# Altium project Audio_Research.PrjPcb (part 4 of 6)

## Sheet Audio_Input_Mic_In.SchDoc: Audio Research: Microphone In
size A4; DrawnBy: Connor Dack; Engineer: Connor Dack; DocumentNumber: 13; Revision: 1.0; SheetNumber: 13; SheetTotal: 20
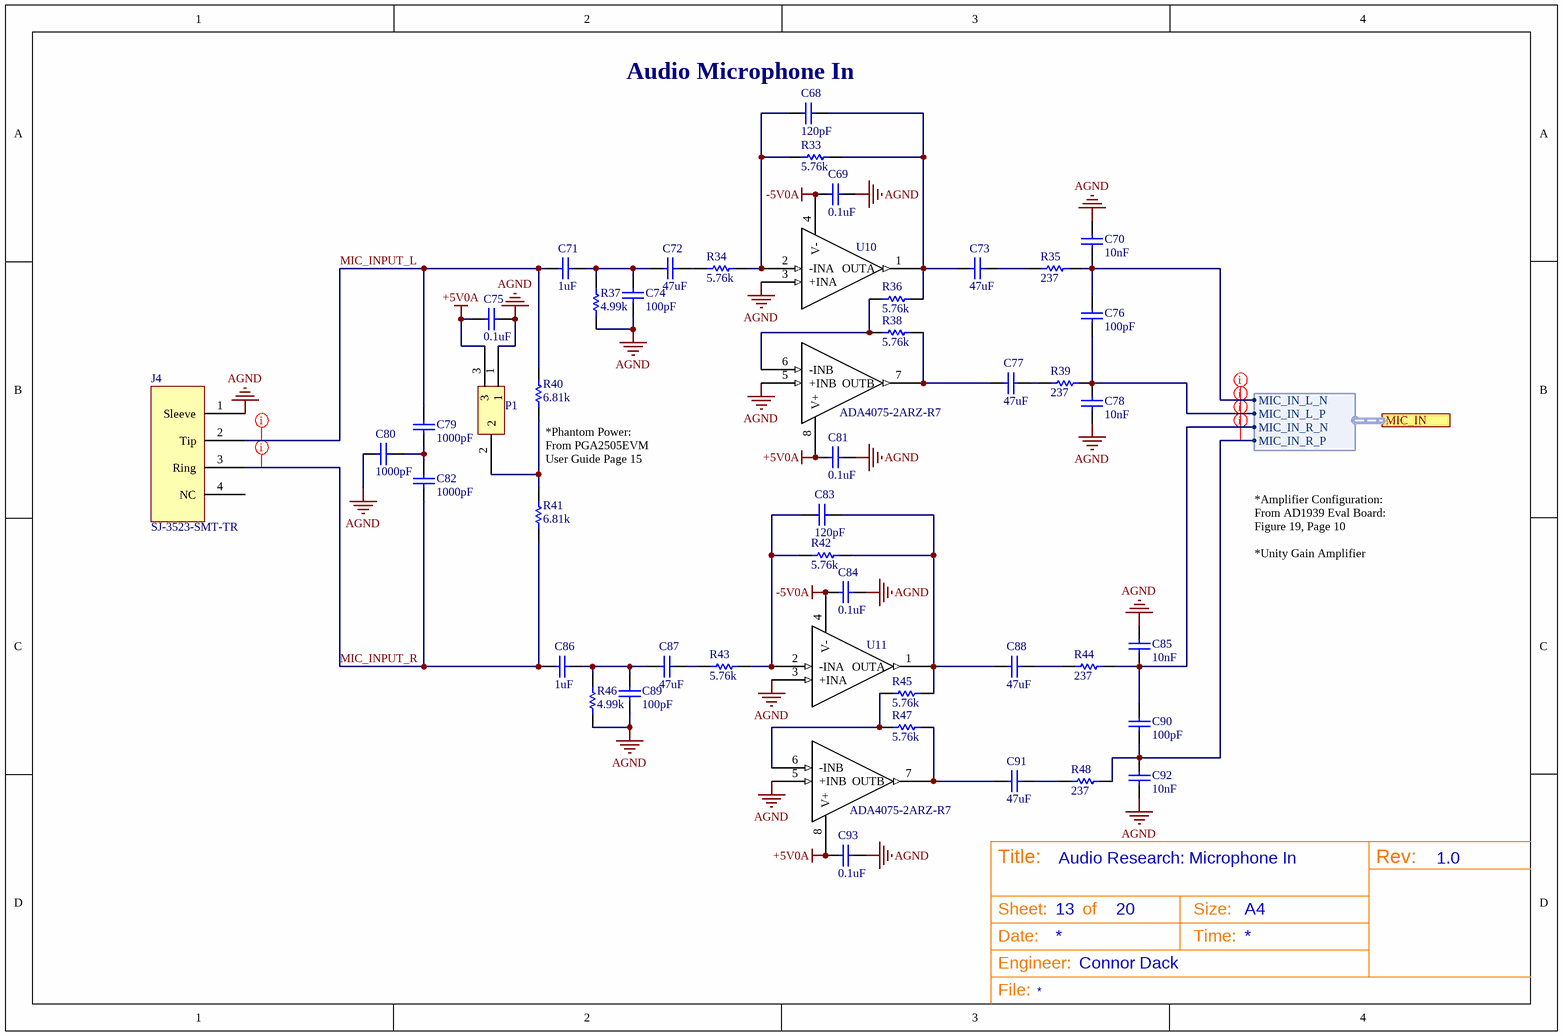
[diagram p11: Audio_Input_Mic_In.SchDoc]

### Parts
C68  Capacitance: 120pF  [3-0603_L]  (hidden comment: CL10C121JB8NCNC)
C69  Capacitance: 0.1uF  [3-0603_L]  (hidden comment: CL10F104ZO8NNNC)
C70  Capacitance: 10nF  [3-0603_L]
C71  Capacitance: 1uF  [3-0603_L]  (hidden comment: CGA3E1X7R1C105M080AC)
C72  Capacitance: 47uF  [C1210X25_L]  (hidden comment: CL32A476KOJNNNE)
C73  Capacitance: 47uF  [C1210X25_L]  (hidden comment: CL32A476KOJNNNE)
C74  Capacitance: 100pF  [3-0603_L]  (hidden comment: C1608C0G2A101J)
C75  Capacitance: 0.1uF  [3-0603_L]  (hidden comment: CL10F104ZO8NNNC)
C76  Capacitance: 100pF  [3-0603_L]  (hidden comment: C1608C0G2A101J)
C77  Capacitance: 47uF  [C1210X25_L]  (hidden comment: CL32A476KOJNNNE)
C78  Capacitance: 10nF  [3-0603_L]
C79  Capacitance: 1000pF  [3-0603_L]  (hidden comment: CL10B102KB8NNNC)
C80  Capacitance: 1000pF  [3-0603_L]  (hidden comment: CL10B102KB8NNNC)
C81  Capacitance: 0.1uF  [3-0603_L]  (hidden comment: CL10F104ZO8NNNC)
C82  Capacitance: 1000pF  [3-0603_L]  (hidden comment: CL10B102KB8NNNC)
C83  Capacitance: 120pF  [3-0603_L]  (hidden comment: CL10C121JB8NCNC)
C84  Capacitance: 0.1uF  [3-0603_L]  (hidden comment: CL10F104ZO8NNNC)
C85  Capacitance: 10nF  [3-0603_L]
C86  Capacitance: 1uF  [3-0603_L]  (hidden comment: CGA3E1X7R1C105M080AC)
C87  Capacitance: 47uF  [C1210X25_L]  (hidden comment: CL32A476KOJNNNE)
C88  Capacitance: 47uF  [C1210X25_L]  (hidden comment: CL32A476KOJNNNE)
C89  Capacitance: 100pF  [3-0603_L]  (hidden comment: C1608C0G2A101J)
C90  Capacitance: 100pF  [3-0603_L]  (hidden comment: C1608C0G2A101J)
C91  Capacitance: 47uF  [C1210X25_L]  (hidden comment: CL32A476KOJNNNE)
C92  Capacitance: 10nF  [3-0603_L]
C93  Capacitance: 0.1uF  [3-0603_L]  (hidden comment: CL10F104ZO8NNNC)
J4  SJ-3523-SMT-TR  [SJ-3523-SMT-TR]
P1  3PIN_Connector  [3Pin_Header]  (value not drawn)
R33  Resistance (Ohms): 5.76k  [3-0603_R_L]  (hidden comment: ERJ-3EKF5761V)
R34  Resistance (Ohms): 5.76k  [3-0603_R_L]  (hidden comment: ERJ-3EKF5761V)
R35  Resistance (Ohms): 237  [3-0603_R_L]  (hidden comment: ERJ-3EKF2370V)
R36  Resistance (Ohms): 5.76k  [3-0603_R_L]  (hidden comment: ERJ-3EKF5761V)
R37  Resistance (Ohms): 4.99k  [3-0603_R_L]  (hidden comment: ERJ-3EKF4991V)
R38  Resistance (Ohms): 5.76k  [3-0603_R_L]  (hidden comment: ERJ-3EKF5761V)
R39  Resistance (Ohms): 237  [3-0603_R_L]  (hidden comment: ERJ-3EKF2370V)
R40  Resistance: 6.81k  [3-0603_R_L]  (hidden comment: ERJ-3EKF6811V)
R41  Resistance: 6.81k  [3-0603_R_L]  (hidden comment: ERJ-3EKF6811V)
R42  Resistance (Ohms): 5.76k  [3-0603_R_L]  (hidden comment: ERJ-3EKF5761V)
R43  Resistance (Ohms): 5.76k  [3-0603_R_L]  (hidden comment: ERJ-3EKF5761V)
R44  Resistance (Ohms): 237  [3-0603_R_L]  (hidden comment: ERJ-3EKF2370V)
R45  Resistance (Ohms): 5.76k  [3-0603_R_L]  (hidden comment: ERJ-3EKF5761V)
R46  Resistance (Ohms): 4.99k  [3-0603_R_L]  (hidden comment: ERJ-3EKF4991V)
R47  Resistance (Ohms): 5.76k  [3-0603_R_L]  (hidden comment: ERJ-3EKF5761V)
R48  Resistance (Ohms): 237  [3-0603_R_L]  (hidden comment: ERJ-3EKF2370V)
U10  ADA4075-2ARZ-R7  [SOIC127P600X175-8L]
U11  ADA4075-2ARZ-R7  [SOIC127P600X175-8L]

### Ports
MIC_IN (harness MIC_IN)

### Harnesses
MIC_IN: MIC_IN_R_P, MIC_IN_R_N, MIC_IN_L_N, MIC_IN_L_P

### Nets
+5V0A: C75.2 C81.2 C93.2 P1.3 U10.8(V+) U11.8(V+)
-5V0A: C69.2 C84.2 U10.4(V-) U11.4(V-)
AGND: C69.1 C70.2 C74.2 C75.1 C78.1 C80.2 C81.1 C84.1 C85.2 C89.2 C92.1 C93.1 J4.1(Sleeve) P1.1 R37.1 R46.1 U10.3(+INA) U10.5(+INB) U11.3(+INA) U11.5(+INB)
MIC_INPUT_L: C71.1 C79.2 J4.2(Tip) R40.2
MIC_INPUT_R: C82.1 C86.1 J4.3(Ring) R41.1
NetC68_1: C68.1 R33.1 R34.2 U10.2(-INA)
NetC68_2: C68.2 C73.1 R33.2 R36.1 U10.1(OUTA)
NetC70_1: C70.1 C76.2 R35.2 ; port MIC_IN.MIC_IN_L_N
NetC71_2: C71.2 C72.1 C74.1 R37.2
NetC72_2: C72.2 R34.1
NetC73_2: C73.2 R35.1
NetC76_1: C76.1 C78.2 R39.2 ; port MIC_IN.MIC_IN_L_P
NetC77_1: C77.1 R38.2 U10.7(OUTB)
NetC77_2: C77.2 R39.1
NetC79_1: C79.1 C80.1 C82.2
NetC83_1: C83.1 R42.1 R43.2 U11.2(-INA)
NetC83_2: C83.2 C88.1 R42.2 R45.1 U11.1(OUTA)
NetC85_1: C85.1 C90.2 R44.2 ; port MIC_IN.MIC_IN_R_N
NetC86_2: C86.2 C87.1 C89.1 R46.2
NetC87_2: C87.2 R43.1
NetC88_2: C88.2 R44.1
NetC90_1: C90.1 C92.2 R48.2 ; port MIC_IN.MIC_IN_R_P
NetC91_1: C91.1 R47.2 U11.7(OUTB)
NetC91_2: C91.2 R48.1
NetP1_2: P1.2 R40.1 R41.2
NetR36_2: R36.2 R38.1 U10.6(-INB)
NetR45_2: R45.2 R47.1 U11.6(-INB)

Not connected (* = marked no-connect by the designer): J4 4(NC)

### Layout directives
net class Mic_In: NetC70_1, NetC76_1, NetC85_1, NetC90_1
net class Mic_In_3.5mm: MIC_INPUT_L, MIC_INPUT_R

### Notes on the sheet
- (near C68) Audio Microphone In
- (near R40) *Phantom Power: From PGA2505EVM User Guide Page 15
- *Amplifier Configuration: From AD1939 Eval Board: Figure 19, Page 10
  *Unity Gain Amplifier
- Title:
- Sheet:
- of
- Size:
- A4
- Rev:
- Date:
- Engineer:
- Time:
- File:

### Library data of the parts
C68 C83 = CL10C121JB8NCNC: 120pF 50V Ceramic Capacitor C0G, NP0 0603 (1608 Metric) 0.063" L x 0.031" W (1.60mm x 0.80mm); Manufacturer: Samsung Electro-Mechanics America, Inc.; Tolerance: ±5%; Supplier 1: Digi-Key; Manufacturer Part Number: CL10C121JB8NCNC; RoHS: RoHS Compliant; Category: Capacitors; Stock 1: 26285; Pricing 1: 1=0.1, 10=0.03, 25=0.0208, 50=0.016, 100=0.0135, 500=0.00948, 1000=0.00738 (USD); Packaging: Cut Tape (CT); Part Status: Active; Voltage - Rated: 50V; Temperature Coefficient: C0G, NP0; Mounting Type: Surface Mount, MLCC; Operating Temperature: -55°C ~ 125°C; Applications: General Purpose; Ratings: -; Package / Case: 0603 (1608 Metric); Size / Dimension: 0.063" L x 0.031" W (1.60mm x 0.80mm); Height - Seated (Max): -; Thickness (Max): 0.035" (0.90mm); Lead Spacing: -; Features: -; Lead Style: -; ComponentLink1URL: http://media.digikey.com/pdf/Data%20Sheets/Samsung%20PDFs/CL10C121JB8NCNC_Spec.pdf; ComponentLink1Description: http://media.digikey.com/pdf/Data%20Sheets/Samsung%20PDFs/CL10C121JB8NCNC_Spec.pdf; Supplier Part Number 1: 1276-2180-1-ND; Load Status: *
C69 C75 C81 C84 C93 = CL10F104ZO8NNNC: CAP CER 0.1UF 16V Y5V 0603; Manufacturer: Samsung; Tolerance: 80%; Supplier 1: Digi-Key; Stock 1: 40000; Pricing 1: 1=0.1, 10=0.038, 100=0.0169, 500=0.01208, 1000=0.00949 (USD); Mount: Surface Mount; Case/Package: 0603; Case Code (Metric): 1608; Case Code (Imperial): 0603; Min Operating Temperature: -30°C; Max Operating Temperature: 85°C; Package Quantity: 1; Packaging: Tape and Reel; Voltage Rating: 16V; Dielectric: Y5V; Length: 1.6mm; Height: 0.8mm; Width: 0.031inch; Thickness: 0.035inch; Depth: 0.8mm; Radiation Hardening: No; ComponentLink1URL: https://datasheet.ciiva.com/25805/cl10f104zo8nnnc-25805810.pdf; ComponentLink1Description: https://datasheet.ciiva.com/25805/cl10f104zo8nnnc-25805810.pdf; ComponentLink2URL: https://datasheet.ciiva.com/16199/cl10f104zo8nnnc-16199254.pdf; ComponentLink2Description: https://datasheet.ciiva.com/16199/cl10f104zo8nnnc-16199254.pdf; Supplier Part Number 1: 1276-1258-6-ND; Manufacturer Part Number: CL10F104ZO8NNNC
C70 C78 C85 C92 = C1608C0G1H050C080AA: CAP CER 10000PF 200V X7R 0603; Manufacturer: KEMET; Dielectric Material: Ceramic; Tolerance: 5%; Supplier 1: Digi-Key; Manufacturer Part Number: C0603C103J2RACTU; Stock 1: 2052; Pricing 1: 1=0.57, 10=0.392, 100=0.2355, 500=0.1766, 1000=0.14913 (USD); Mount: Surface Mount; Case/Package: 0603; Case Code (Metric): 1608; Case Code (Imperial): 0603; Min Operating Temperature: -55°C; Max Operating Temperature: 125°C; Package Quantity: 1; Voltage Rating: 200V; Packaging: Tape and Reel; Voltage Rating (DC): 200V; Dielectric: X7R; Termination: SMD/SMT; Length: 1.6mm; Height: 0.8mm; Width: 0.031inch; Thickness: 0.034inch; ComponentLink1URL: https://search.kemet.com/component-edge/download/datasheet/C0603C103J2RACTU.pdf; ComponentLink1Description: https://search.kemet.com/component-edge/download/datasheet/C0603C103J2RACTU.pdf; ComponentLink2URL: http://www.kemet.com/Lists/ProductCatalog/Attachments/53/KEM_C1002_X7R_SMD.pdf; ComponentLink2Description: http://www.kemet.com/Lists/ProductCatalog/Attachments/53/KEM_C1002_X7R_SMD.pdf; Supplier Part Number 1: 399-10040-6-ND
C71 C86 = CGA3E1X7R1C105M080AC: CAP CER 1UF 16V X7R 0603; Manufacturer: TDK; Tolerance: 20%; Supplier 1: Digi-Key; Manufacturer Part Number: CGA3E1X7R1C105M080AC; Stock 1: 18034; Pricing 1: 1=0.14, 10=0.1, 100=0.0468, 500=0.0328, 1000=0.0272 (USD); Mount: Surface Mount; Case/Package: 0603; Weight: 7.1E-05oz; Case Code (Metric): 1608; Case Code (Imperial): 0603; Min Operating Temperature: -55°C; Max Operating Temperature: 125°C; Package Quantity: 4000; Packaging: Tape and Reel; Voltage Rating: 16V; Dielectric: X7R; Termination: SMD/SMT; Voltage Rating (DC): 16V; Length: 0.063inch; Height: 0.8mm; Width: 0.031inch; Thickness: 0.035inch; Lead Free: Lead Free; ComponentLink1URL: https://product.tdk.com/info/en/catalog/datasheets/mlcc_automotive_general_en.pdf; ComponentLink1Description: https://product.tdk.com/info/en/catalog/datasheets/mlcc_automotive_general_en.pdf; ComponentLink2URL: http://product.tdk.com/capacitor/mlcc/detailed_information.php?lang=en&ref=jp&part_no=CGA3E1X7R1C105M080AC; ComponentLink2Description: http://product.tdk.com/capacitor/mlcc/detailed_information.php?lang=en&ref=jp&part_no=CGA3E1X7R1C105M080AC; ComponentLink3URL: http://product.tdk.com/en/catalog/datasheets/mlcc_automotive_general_en.pdf; ComponentLink3Description: http://product.tdk.com/en/catalog/datasheets/mlcc_automotive_general_en.pdf; Supplier Part Number 1: 445-12540-6-ND
C72 C73 C77 C87 C88 C91 = CL32A476KOJNNNE: CAP CER 47UF 16V X5R 1210; Manufacturer: Samsung; Tolerance: 10%; Supplier 1: Digi-Key; Manufacturer Part Number: CL32A476KOJNNNE; Stock 1: 10000; Pricing 1: 1=1.12, 10=0.853, 100=0.6104, 500=0.47254 (USD); Mount: Surface Mount; Case/Package: 1210; Case Code (Metric): 3225; Case Code (Imperial): 1210; Min Operating Temperature: -55°C; Max Operating Temperature: 85°C; Package Quantity: 1; Packaging: Tape and Reel; Voltage Rating: 16V; Dielectric: X5R; Voltage Rating (DC): 16V; Length: 0.126inch; Width: 0.098inch; Thickness: 0.106inch; Lead Free: Lead Free; ComponentLink1URL: https://datasheet.ciiva.com/25785/cl32a476kojnnne-25785873.pdf; ComponentLink1Description: https://datasheet.ciiva.com/25785/cl32a476kojnnne-25785873.pdf; Supplier Part Number 1: 1276-3376-6-ND
C74 C76 C89 C90 = C1608C0G2A101J: CAP CER 100PF 100V 5% NP0 0603; Manufacturer: TDK Corporation; Temperature Coefficient: C0G, NP0; Supplier 1: Digi-Key; Manufacturer Part Number: C1608C0G2A101J; RoHS: RoHS Compliant; Category: Capacitors; Stock 1: 128588; Pricing 1: 10=0.05, 100=0.0231, 250=0.01892, 500=0.01618, 1000=0.0126 (USD); Voltage - Rated: 100V; Tolerance: ±5%; Mounting Type: Surface Mount, MLCC; Operating Temperature: -55°C ~ 125°C; Applications: General Purpose; Ratings: -; Package / Case: 0603 (1608 Metric); Size / Dimension: 0.063" L x 0.031" W (1.60mm x 0.80mm); Height - Seated (Max): -; Thickness (Max): 0.037" (0.95mm); Lead Spacing: -; Features: -; Packaging: Cut Tape (CT); Lead Style: -; ComponentLink1URL: http://www.tdk.com/pdf/mid_volt_B11.pdf; ComponentLink1Description: http://www.tdk.com/pdf/mid_volt_B11.pdf; Supplier Part Number 1: 445-2306-1-ND
  C76 C90: Load Status: *
C79 C80 C82 = CL10B102KB8NNNC: 1000pF 50V Ceramic Capacitor X7R 0603 (1608 Metric) 0.063" L x 0.031" W (1.60mm x 0.80mm); Manufacturer: Samsung Electro-Mechanics America, Inc.; Tolerance: ±10%; Supplier 1: Digi-Key; Manufacturer Part Number: CL10B102KB8NNNC; RoHS: RoHS Compliant; Category: Capacitors; Stock 1: 294007; Pricing 1: 1=0.1, 10=0.017, 25=0.012, 50=0.0092, 100=0.0077, 500=0.0054, 1000=0.0042 (USD); Packaging: Cut Tape (CT); Part Status: Active; Voltage - Rated: 50V; Temperature Coefficient: X7R; Mounting Type: Surface Mount, MLCC; Operating Temperature: -55°C ~ 125°C; Applications: General Purpose; Ratings: -; Package / Case: 0603 (1608 Metric); Size / Dimension: 0.063" L x 0.031" W (1.60mm x 0.80mm); Height - Seated (Max): -; Thickness (Max): 0.035" (0.90mm); Lead Spacing: -; Features: -; Lead Style: -; ComponentLink1URL: http://www.samsungsem.com/kr/support/product-search/mlcc/__icsFiles/afieldfile/2015/06/15/CL10B102KB8NNNC.pdf; ComponentLink1Description: http://www.samsungsem.com/kr/support/product-search/mlcc/__icsFiles/afieldfile/2015/06/15/CL10B102KB8NNNC.pdf; Supplier Part Number 1: 1276-1018-1-ND; Load Status: *
J4 = SJ-3523-SMT-TR: 3.50mm (0.141", 1/8", Mini Plug) - Headphone Phone Jack Stereo Connector Solder; Manufacturer: CUI Inc.; Gender: Female; Actual Diameter: 0.142" (3.60mm); Number of Positions/Contacts: 3 Conductors, 3 Contacts; Internal Switch(s): Does Not Contain Switch; Shielding: Unshielded; Voltage - Rated: 12VDC; Current Rating: 1A; Mating Length/Depth: 0.551" (14.00mm); Body Color: Black; Includes: 1 pc - 1 Connector; Notes: FE Provides: 23; LatestRevisionDate: 17-Jul-2002; LatestRevisionNote: Re-released for DXP Platform.; Publisher: Altium Limited; Supplier 1: Digi-Key; RoHS: RoHS Compliant; Category: Connectors, Interconnects; Stock 1: 104981; Pricing 1: 1=1.34, 10=1.043, 100=0.7961, 500=0.63558 (USD); Packaging: Cut Tape (CT); Part Status: Active; Connector Type: Phone Jack; Signal Lines: Stereo; Industry Recognized Mating Diameter: 3.50mm (0.141", 1/8", Mini Plug) - Headphone; Mounting Type: Surface Mount, Right Angle; Termination: Solder; Features: Board Guide; Insulation Color: -; Contact Material - Plating: Silver; Body Material: -; ComponentLink1URL: http://www.cui.com/product/resource/digikeypdf/sj-352x-smt_series.pdf; ComponentLink1Description: http://www.cui.com/product/resource/digikeypdf/sj-352x-smt_series.pdf; Supplier Part Number 1: CP-3523SJCT-ND; Manufacturer Part Number: SJ-3523-SMT-TR
P1 = CONN_TH_3PIN_0D1: 3 Pin Through Hole Connector with 0.1" Spacing; Manufacturer: Samtec; Manufacturer Part Number: TSW-103-07-G-S; LatestRevisionDate: 17-Jul-2002; LatestRevisionNote: Re-released for DXP Platform.; Publisher: Altium Limited; Supplier 1: Samtec; Supplier Part Number 1: TSW-103-07-G-S
R33 R34 R36 R38 R42 R43 R45 R47 = ERJ-3EKF5761V: RES SMD 5.76K OHM 1% 1/10W 0603; Manufacturer: Panasonic Electronic Components; Power (Watts): 0.1W, 1/10W; Temperature Coefficient: ±100ppm/°C; Supplier 1: Digi-Key; Manufacturer Part Number: ERJ-3EKF5761V; RoHS: RoHS Compliant; Category: Resistors; Stock 1: 90842; Pricing 1: 1=0.1, 50=0.0114, 100=0.0084, 250=0.00644, 500=0.00514, 1000=0.00379 (USD); Packaging: Cut Tape (CT); Part Status: Active; Tolerance: ±1%; Composition: Thick Film; Features: Automotive AEC-Q200; Operating Temperature: -55°C ~ 155°C; Package / Case: 0603 (1608 Metric); Supplier Device Package: 0603; Size / Dimension: 0.063" L x 0.031" W (1.60mm x 0.80mm); Height: 0.022" (0.55mm); Number of Terminations: 2; ComponentLink1URL: http://industrial.panasonic.com/www-cgi/jvcr13pz.cgi?E+PZ+3+AOA0002+ERJ3EKF5761V+7+WW; ComponentLink1Description: http://industrial.panasonic.com/www-cgi/jvcr13pz.cgi?E+PZ+3+AOA0002+ERJ3EKF5761V+7+WW; Supplier Part Number 1: P5.76KHCT-ND; Load Status: *
R35 R39 R44 R48 = ERJ-3EKF2370V: RES SMD 237 OHM 1% 1/10W 0603; Manufacturer: Panasonic Electronic Components; Power (Watts): 0.1W, 1/10W; Temperature Coefficient: ±100ppm/°C; Supplier 1: Digi-Key; Manufacturer Part Number: ERJ-3EKF2370V; RoHS: RoHS Compliant; Category: Resistors; Stock 1: 74413; Pricing 1: 1=0.1, 50=0.0114, 100=0.0084, 250=0.00644, 500=0.00514, 1000=0.00379 (USD); Packaging: Cut Tape (CT); Part Status: Active; Tolerance: ±1%; Composition: Thick Film; Features: Automotive AEC-Q200; Operating Temperature: -55°C ~ 155°C; Package / Case: 0603 (1608 Metric); Supplier Device Package: 0603; Size / Dimension: 0.063" L x 0.031" W (1.60mm x 0.80mm); Height: 0.022" (0.55mm); Number of Terminations: 2; ComponentLink1URL: http://industrial.panasonic.com/www-cgi/jvcr13pz.cgi?E+PZ+3+AOA0002+ERJ3EKF2370V+7+WW; ComponentLink1Description: http://industrial.panasonic.com/www-cgi/jvcr13pz.cgi?E+PZ+3+AOA0002+ERJ3EKF2370V+7+WW; Supplier Part Number 1: P237HCT-ND; Load Status: *
R37 R46 = ERJ-3EKF4991V: RES SMD 4.99K OHM 1% 1/10W 0603; Manufacturer: Panasonic Electronic Components; Power (Watts): 0.1W, 1/10W; Temperature Coefficient: ±100ppm/°C; Supplier 1: Digi-Key; Manufacturer Part Number: ERJ-3EKF4991V; RoHS: RoHS Compliant; Category: Resistors; Stock 1: 870970; Pricing 1: 1=0.1, 50=0.0114, 100=0.0084, 250=0.00644, 500=0.00514, 1000=0.00379 (USD); Packaging: Cut Tape (CT); Part Status: Active; Tolerance: ±1%; Composition: Thick Film; Features: Automotive AEC-Q200; Operating Temperature: -55°C ~ 155°C; Package / Case: 0603 (1608 Metric); Supplier Device Package: 0603; Size / Dimension: 0.063" L x 0.031" W (1.60mm x 0.80mm); Height: 0.022" (0.55mm); Number of Terminations: 2; ComponentLink1URL: http://industrial.panasonic.com/www-cgi/jvcr13pz.cgi?E+PZ+3+AOA0002+ERJ3EKF4991V+7+WW; ComponentLink1Description: http://industrial.panasonic.com/www-cgi/jvcr13pz.cgi?E+PZ+3+AOA0002+ERJ3EKF4991V+7+WW; Supplier Part Number 1: P4.99KHCT-ND
R40 R41 = ERJ-3EKF6811V: RES SMD 6.81K OHM 1% 1/10W 0603; Manufacturer: Panasonic ECG; Voltage Rating: 75V; Power Rating: 100mW; Temperature Coefficient: 100ppm/°C; Voltage Rating (DC): 50V; Stock 1: 326226; Pricing 1: 1=0.1, 10=0.063, 100=0.0257, 1000=0.0115, 2500=0.01 (USD); Mount: Surface Mount; Case/Package: 0603; Case Code (Imperial): 0603; Case Code (Metric): 1608; Contact Plating: Tin; Min Operating Temperature: -55°C; Max Operating Temperature: 155°C; Tolerance: 1%; Packaging: Tape and Reel; Package Quantity: 1; Composition: Thick Film; Number of Terminations: 2; Termination: SMD/SMT; Military Standard: Not; Max Power Dissipation: 100mW; Length: 1.6mm; Height: 0.45mm; Width: 0.8mm; Depth: 0.8mm; Radiation Hardening: No; REACH SVHC: Unknown; Lead Free: Lead Free; ComponentLink1URL: https://datasheet.ciiva.com/9117/aoa0000ce2-9117125.pdf; ComponentLink1Description: https://datasheet.ciiva.com/9117/aoa0000ce2-9117125.pdf; ComponentLink2URL: https://datasheet.ciiva.com/46389/426256-46389990.pdf; ComponentLink2Description: https://datasheet.ciiva.com/46389/426256-46389990.pdf; ComponentLink3URL: https://datasheet.ciiva.com/24027/aoa0000ce2-24027336.pdf; ComponentLink3Description: https://datasheet.ciiva.com/24027/aoa0000ce2-24027336.pdf; ComponentLink4URL: https://datasheet.ciiva.com/28693/1678782-28693560.pdf; ComponentLink4Description: https://datasheet.ciiva.com/28693/1678782-28693560.pdf; ComponentLink5URL: https://datasheet.ciiva.com/5969/426256-5969386.pdf; ComponentLink5Description: https://datasheet.ciiva.com/5969/426256-5969386.pdf; ComponentLink6URL: https://datasheet.ciiva.com/16440/aoa0000ce2-16440170.pdf; ComponentLink6Description: https://datasheet.ciiva.com/16440/aoa0000ce2-16440170.pdf; ComponentLink7URL: https://datasheet.ciiva.com/48531/aoa0000ce2-48531934.pdf; ComponentLink7Description: https://datasheet.ciiva.com/48531/aoa0000ce2-48531934.pdf; ComponentLink8URL: https://datasheet.ciiva.com/16759/70260748-16759487.pdf; ComponentLink8Description: https://datasheet.ciiva.com/16759/70260748-16759487.pdf; ComponentLink9URL: https://datasheet.ciiva.com/43460/426256-43460527.pdf; ComponentLink9Description: https://datasheet.ciiva.com/43460/426256-43460527.pdf; Supplier Part Number 1: P6.81KHDKR-ND; Supplier 1: Digi-Key; Manufacturer Part Number: ERJ-3EKF6811V
U10 U11 = ADA4075-2ARZ-R7: IC OPAMP GP 6.5MHZ 8SOIC; Manufacturer: Analog Devices Inc.; Amplifier Type: General Purpose; Number of Circuits: 2; Slew Rate: 12 V/µs; Current - Input Bias: 30nA; Voltage - Input Offset: 200µV; Current - Supply: 1.8mA; Current - Output / Channel: 40mA; Voltage - Supply, Single/Dual (±): ±4.5 V ~ 18 V; Supplier 1: Digi-Key; RoHS: RoHS Compliant; Category: Integrated Circuits (ICs); Stock 1: 11196; Pricing 1: 1=2.28, 10=2.05, 100=1.6441, 500=1.35136 (USD); Packaging: Cut Tape (CT); Part Status: Active; Output Type: -; Gain Bandwidth Product: 6.5MHz; -3db Bandwidth: -; Operating Temperature: -40°C ~ 125°C; Mounting Type: Surface Mount; Package / Case: 8-SOIC (0.154", 3.90mm Width); Supplier Device Package: 8-SOIC; ComponentLink1URL: http://www.analog.com/media/en/technical-documentation/data-sheets/ADA4075-2.pdf; ComponentLink1Description: http://www.analog.com/media/en/technical-documentation/data-sheets/ADA4075-2.pdf; Supplier Part Number 1: ADA4075-2ARZ-R7CT-ND; Manufacturer Part Number: ADA4075-2ARZ-R7

## Sheet Audio_Input_Mic_Array.SchDoc: Audio Research: MEMS Microphone Array
size A4; DrawnBy: Connor Dack; Engineer: Connor Dack; DocumentNumber: 15; Revision: 1.0; SheetNumber: 15; SheetTotal: 20
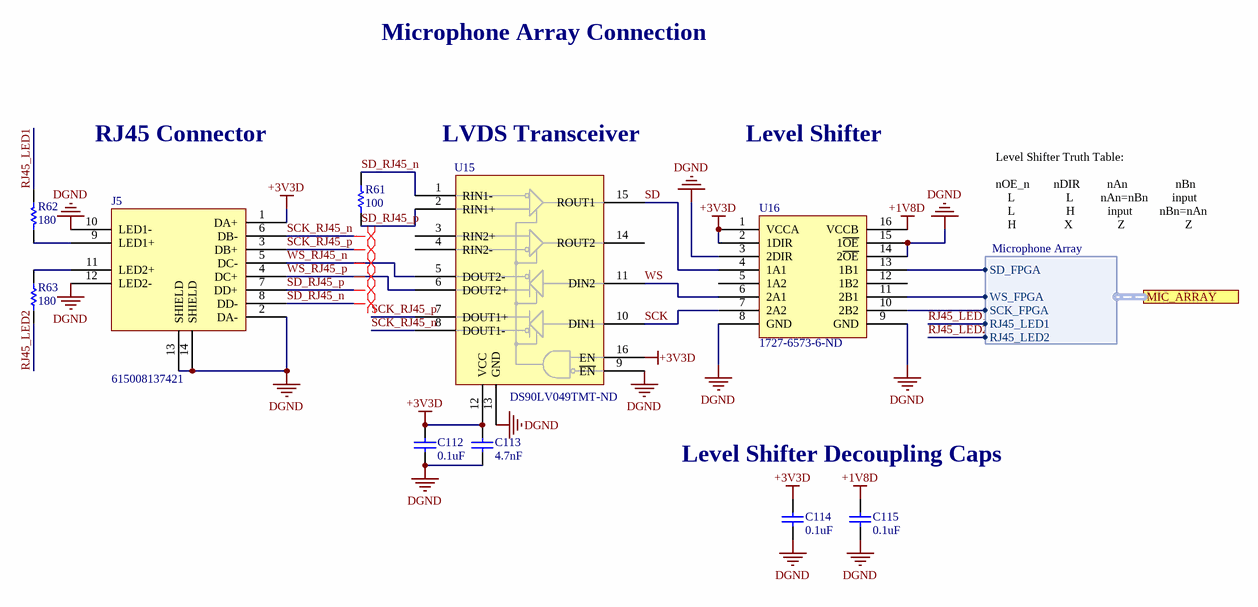
[diagram p12: Audio_Input_Mic_Array.SchDoc]

### Parts
C112  Capacitance: 0.1uF  [3-0603_L]  (hidden comment: CL10F104ZO8NNNC)
C113  Capacitance: 4.7nF  [3-0603_L]  (hidden comment: C0603C472K8RACTU)
C114  Capacitance: 0.1uF  [3-0603_L]  (hidden comment: CL10F104ZO8NNNC)
C115  Capacitance: 0.1uF  [3-0603_L]  (hidden comment: CL10F104ZO8NNNC)
J5  CONN MOD JACK 8P8C R/A SHIELDED  [RJ45]  (value not drawn)
R61  Resistance: 100  [3-0603_R_L]  (hidden comment: ERA-3AEB101V)
R62  Resistance: 180  [3-0603_R_L]  (hidden comment: ERA-3AEB181V)
R63  Resistance: 180  [3-0603_R_L]  (hidden comment: ERA-3AEB181V)
U15  Supplier Part Number 1: DS90LV049TMT-ND  [TSOP65P640X120-16N]  (hidden comment: DS90LV049TMT)
U16  Supplier Part Number 1: 1727-6573-6-ND  [TSOP65P640X120-16N]  (hidden comment: IC TXRX 4BIT DUAL 3ST 16TSSOP)

### Ports
MIC_ARRAY (harness Microphone Array)

### Harnesses
Microphone Array: SD_FPGA, SCK_FPGA, WS_FPGA, RJ45_LED1, RJ45_LED2

### Nets
+1V8D: C115.1 U16.16(VCCB)
+3V3D: C112.1 C113.2 C114.1 J5.1(DA+) U15.12(VCC) U15.16(EN) U16.1(VCCA) U16.2(1DIR)
DGND: C112.2 C113.1 C114.2 C115.2 J5.2(DA-) J5.10(LED1-) J5.12(LED2-) J5.13(SHIELD) J5.14(SHIELD) U15.9(~{EN}) U15.13(GND) U16.3(2DIR) U16.8(GND) U16.9(GND) U16.14(2~{OE}) U16.15(1~{OE})  [project net AGND]
RJ45_LED1: R62.1 ; port MIC_ARRAY.RJ45_LED1
RJ45_LED2: R63.1 ; port MIC_ARRAY.RJ45_LED2
SCK: U15.10(DIN1) U16.7(2A2)
SCK_RJ45_n: J5.6(DB-) U15.8(DOUT1-)
SCK_RJ45_p: J5.3(DB+) U15.7(DOUT1+)
SD: U15.15(ROUT1) U16.4(1A1)
SD_RJ45_n: J5.8(DD-) R61.2 U15.1(RIN1-)
SD_RJ45_p: J5.7(DD+) R61.1 U15.2(RIN1+)
WS: U15.11(DIN2) U16.6(2A1)
WS_RJ45_n: J5.5(DC-) U15.5(DOUT2-)
WS_RJ45_p: J5.4(DC+) U15.6(DOUT2+)
NetJ1_H32: U16.11(2B1) ; port MIC_ARRAY.WS_FPGA
NetJ1_H34: U16.13(1B1) ; port MIC_ARRAY.SD_FPGA
NetJ1_H38: U16.10(2B2) ; port MIC_ARRAY.SCK_FPGA
NetJ5_9: J5.9(LED1+) R62.2
NetJ5_11: J5.11(LED2+) R63.2

Not connected (* = marked no-connect by the designer): U15 3(RIN2+) 4(RIN2-) 14(ROUT2); U16 5(1A2) 12(1B2)

### Layout directives
differential pair: SCK_RJ45_n, SCK_RJ45_p, SD_RJ45_n, SD_RJ45_p, WS_RJ45_n, WS_RJ45_p

### Notes on the sheet
- Microphone Array Connection
- RJ45 Connector
- (near U15) LVDS Transceiver
- Level Shifter
- Level Shifter Truth Table:
  nOE_n        nDIR         nAn                nBn
  L                 L         nAn=nBn        input
  L                 H           input         nBn=nAn
  H                X               Z                    Z
- Level Shifter Decoupling Caps
- Title:
- Sheet:
- of
- Size:
- A4
- Rev:
- Date:
- Engineer:
- Time:
- File:

### Library data of the parts
C112 C114 C115 = CL10F104ZO8NNNC: as C69 on sheet Audio_Input_Mic_In; Supplier 1: Digi-Key; Stock 1: 40000; Pricing 1: 1=0.1, 10=0.038, 100=0.0169, 500=0.01208, 1000=0.00949 (USD); Mount: Surface Mount; Case/Package: 0603; Case Code (Metric): 1608; Case Code (Imperial): 0603; Min Operating Temperature: -30°C; Max Operating Temperature: 85°C; Package Quantity: 1; Packaging: Tape and Reel; Voltage Rating: 16V; Dielectric: Y5V; Length: 1.6mm; Height: 0.8mm; Width: 0.031inch; Thickness: 0.035inch; Depth: 0.8mm; Radiation Hardening: No; ComponentLink1URL: https://datasheet.ciiva.com/25805/cl10f104zo8nnnc-25805810.pdf; ComponentLink1Description: https://datasheet.ciiva.com/25805/cl10f104zo8nnnc-25805810.pdf; ComponentLink2URL: https://datasheet.ciiva.com/16199/cl10f104zo8nnnc-16199254.pdf; ComponentLink2Description: https://datasheet.ciiva.com/16199/cl10f104zo8nnnc-16199254.pdf; Supplier Part Number 1: 1276-1258-6-ND; Manufacturer Part Number: CL10F104ZO8NNNC
C113 = C0603C472K8RACTU: CAP CER 4700PF 10V X7R 0603; Manufacturer: KEMET; Dielectric Material: Ceramic; Tolerance: 10%; Supplier 1: Digi-Key; Manufacturer Part Number: C0603C472K8RACTU; Stock 1: 15005; Pricing 1: 1=0.1, 10=0.053, 100=0.0236, 500=0.0168, 1000=0.0132 (USD); Mount: Surface Mount; Case/Package: 0603; Case Code (Metric): 1608; Case Code (Imperial): 0603; Contact Plating: Tin,Matte; Min Operating Temperature: -55°C; Max Operating Temperature: 125°C; Voltage Rating: 10V; Packaging: Tape and Reel; Package Quantity: 4000; Voltage Rating (DC): 10V; Dielectric: X7R; Termination: SMD/SMT; Length: 1.6mm; Width: 0.031inch; Thickness: 0.034inch; Depth: 0.8mm; REACH SVHC: No SVHC; ComponentLink1URL: http://www.mouser.com/ds/2/212/KEM_C1002_X7R_SMD-1102033.pdf; ComponentLink1Description: http://www.mouser.com/ds/2/212/KEM_C1002_X7R_SMD-1102033.pdf; ComponentLink2URL: http://components.arrow.com/part/dataview/3445604S8609586N7429; ComponentLink2Description: http://components.arrow.com/part/dataview/3445604S8609586N7429; ComponentLink3URL: https://search.kemet.com/component-edge/download/datasheet/C0603C472K8RACTU.pdf; ComponentLink3Description: https://search.kemet.com/component-edge/download/datasheet/C0603C472K8RACTU.pdf; ComponentLink4URL: http://capacitoredge.kemet.com/capedge2/DataSheet?pn=C0603C472K8RAC7867; ComponentLink4Description: http://capacitoredge.kemet.com/capedge2/DataSheet?pn=C0603C472K8RAC7867; Supplier Part Number 1: 399-9092-6-ND
J5 = 615008137421: Jack Modular Connector 8p8c (RJ45, Ethernet) 90° Angle (Right) Shielded, EMI Finger Cat5; Manufacturer: Wurth Electronics; Current Rating: 1.5A; Mating Cycles: 500; Gender: Female; Connector Type: RJ45,Socket,Jack; Voltage Rating (AC): 120V; Number of Positions: 8; Number of Ports: 1; Insulation Resistance: 500MR; Direction: Up; Supplier 1: Digi-Key; Stock 1: 1494; Pricing 1: 1=2.67, 10=2.621, 50=2.52, 100=2.419, 250=2.318 (USD); Mount: Through Hole,PCB; Contact Plating: Tin,Gold; Contact Material: Copper Alloy; Colour: Black,Green,Yellow; Housing Material: PBT; Min Operating Temperature: -40°C; Max Operating Temperature: 85°C; Shielding: Shielded; Packaging: Tray; Package Quantity: 60; Number of Rows: 1; Termination: Through Hole; Number of Contacts: 8; Orientation: Right Angle; Length: 13.46mm; Height: 16.93mm; Width: 16.25mm; Depth: 15.75mm; REACH SVHC: Unknown; Flammability Rating: UL94 V-0; ComponentLink1URL: https://datasheet.ciiva.com/11726/0900766b80f88673-11726176.pdf; ComponentLink1Description: https://datasheet.ciiva.com/11726/0900766b80f88673-11726176.pdf; ComponentLink2URL: https://datasheet.ciiva.com/4561/615008137421-71402-4561624.pdf; ComponentLink2Description: https://datasheet.ciiva.com/4561/615008137421-71402-4561624.pdf; ComponentLink3URL: https://datasheet.ciiva.com/686/615008137421-686729.pdf; ComponentLink3Description: https://datasheet.ciiva.com/686/615008137421-686729.pdf; ComponentLink4URL: https://datasheet.ciiva.com/6913/76606-6913951.pdf; ComponentLink4Description: https://datasheet.ciiva.com/6913/76606-6913951.pdf; ComponentLink5URL: https://datasheet.ciiva.com/48689/001088215-da-01-en-wr-com-modular-jack-615008137421-48689541.pdf; ComponentLink5Description: https://datasheet.ciiva.com/48689/001088215-da-01-en-wr-com-modular-jack-615008137421-48689541.pdf; Supplier Part Number 1: 732-2112-ND; Manufacturer Part Number: 615008137421
R61 = ERA-3AEB101V: RES SMD 100 OHM 0.1% 1/10W 0603; Manufacturer: Panasonic ECG; Power Rating: 100mW; Voltage Rating: 75V; Temperature Coefficient: 25ppm/°C; Supplier 1: Digi-Key; Manufacturer Part Number: ERA-3AEB101V; Stock 1: 123480; Pricing 1: 1=0.35, 10=0.3, 100=0.1172, 1000=0.0491, 2500=0.045 (USD); Mount: Surface Mount; Case/Package: 0603; Number of Pins: 2; Case Code (Metric): 1608; Case Code (Imperial): 0603; Contact Plating: Tin; Min Operating Temperature: -55°C; Max Operating Temperature: 155°C; Tolerance: 0.1%; Packaging: Tape and Reel; Package Quantity: 5000; Composition: Metal Film,Thin Film; Number of Terminations: 2; Termination: SMD/SMT; Military Standard: Not; Max Power Dissipation: 100mW; Length: 1.6mm; Height: 0.45mm; Width: 0.8mm; Depth: 0.8mm; Radiation Hardening: No; REACH SVHC: No SVHC; ComponentLink1URL: https://datasheet.ciiva.com/46422/485442-46422517.pdf; ComponentLink1Description: https://datasheet.ciiva.com/46422/485442-46422517.pdf; ComponentLink2URL: https://datasheet.ciiva.com/7830/485442-7830582.pdf; ComponentLink2Description: https://datasheet.ciiva.com/7830/485442-7830582.pdf; ComponentLink3URL: https://datasheet.ciiva.com/46422/485442-46422518.pdf; ComponentLink3Description: https://datasheet.ciiva.com/46422/485442-46422518.pdf; ComponentLink4URL: https://datasheet.ciiva.com/17207/aoa0000ce26-17207959.pdf; ComponentLink4Description: https://datasheet.ciiva.com/17207/aoa0000ce26-17207959.pdf; ComponentLink5URL: https://datasheet.ciiva.com/5734/485442-5734520.pdf; ComponentLink5Description: https://datasheet.ciiva.com/5734/485442-5734520.pdf; ComponentLink6URL: https://datasheet.ciiva.com/5734/485442-5734521.pdf; ComponentLink6Description: https://datasheet.ciiva.com/5734/485442-5734521.pdf; ComponentLink7URL: https://datasheet.ciiva.com/28513/39837-28513817.pdf; ComponentLink7Description: https://datasheet.ciiva.com/28513/39837-28513817.pdf; ComponentLink8URL: https://datasheet.ciiva.com/11808/0900766b80fe20f7-11808029.pdf; ComponentLink8Description: https://datasheet.ciiva.com/11808/0900766b80fe20f7-11808029.pdf; ComponentLink9URL: https://datasheet.ciiva.com/16725/70068849-16725037.pdf; ComponentLink9Description: https://datasheet.ciiva.com/16725/70068849-16725037.pdf; ComponentLink10URL: https://datasheet.ciiva.com/45928/54aoa0000ce26-45928637.pdf; ComponentLink10Description: https://datasheet.ciiva.com/45928/54aoa0000ce26-45928637.pdf; ComponentLink11URL: https://datasheet.ciiva.com/9186/aoa0000ce26-9186735.pdf; ComponentLink11Description: https://datasheet.ciiva.com/9186/aoa0000ce26-9186735.pdf; ComponentLink12URL: https://datasheet.ciiva.com/48425/era-eng-tds-48425407.pdf; ComponentLink12Description: https://datasheet.ciiva.com/48425/era-eng-tds-48425407.pdf; ComponentLink13URL: https://datasheet.ciiva.com/29183/450355-da-01-en-widerstand-0603-era-29183658.pdf; ComponentLink13Description: https://datasheet.ciiva.com/29183/450355-da-01-en-widerstand-0603-era-29183658.pdf; Supplier Part Number 1: P100DBDKR-ND
R62 R63 = ERA-3AEB181V: RES SMD 180 OHM 0.1% 1/10W 0603; Manufacturer: Panasonic; Manufacturer Part Number: ERA3AEB181V; Power Rating: 100mW; Voltage Rating: 75V; Temperature Coefficient: 25ppm/°C; Stock 1: 9289; Pricing 1: 1=0.35, 10=0.3, 100=0.1172, 1000=0.0491, 2500=0.045 (USD); Mount: Surface Mount; Case/Package: 0603; Number of Pins: 2; Case Code (Metric): 1608; Case Code (Imperial): 0603; Contact Plating: Tin; Min Operating Temperature: -55°C; Max Operating Temperature: 155°C; Composition: Thin Film; Tolerance: 0.1%; Packaging: Tape and Reel; Package Quantity: 1; Number of Terminations: 2; Termination: SMD/SMT; Military Standard: Not; Max Power Dissipation: 100mW; Voltage Rating (DC): 75V; Length: 1.6mm; Height: 0.45mm; Width: 0.8mm; Depth: 0.8mm; Radiation Hardening: No; REACH SVHC: No SVHC; Lead Free: Lead Free; ComponentLink1URL: https://datasheet.ciiva.com/11808/0900766b80fe20f7-11808021.pdf; ComponentLink1Description: https://datasheet.ciiva.com/11808/0900766b80fe20f7-11808021.pdf; ComponentLink2URL: https://datasheet.ciiva.com/9184/aoa0000ce26-9184902.pdf; ComponentLink2Description: https://datasheet.ciiva.com/9184/aoa0000ce26-9184902.pdf; ComponentLink3URL: https://datasheet.ciiva.com/30263/54aoa0000ce26-30263318.pdf; ComponentLink3Description: https://datasheet.ciiva.com/30263/54aoa0000ce26-30263318.pdf; ComponentLink4URL: https://datasheet.ciiva.com/5860/485442-5860503.pdf; ComponentLink4Description: https://datasheet.ciiva.com/5860/485442-5860503.pdf; ComponentLink5URL: https://datasheet.ciiva.com/48425/era-eng-tds-48425431.pdf; ComponentLink5Description: https://datasheet.ciiva.com/48425/era-eng-tds-48425431.pdf; ComponentLink6URL: https://datasheet.ciiva.com/5860/485442-5860505.pdf; ComponentLink6Description: https://datasheet.ciiva.com/5860/485442-5860505.pdf; ComponentLink7URL: https://datasheet.ciiva.com/9117/aoa0000ce26-9117390.pdf; ComponentLink7Description: https://datasheet.ciiva.com/9117/aoa0000ce26-9117390.pdf; ComponentLink8URL: https://datasheet.ciiva.com/7909/485442-7909087.pdf; ComponentLink8Description: https://datasheet.ciiva.com/7909/485442-7909087.pdf; ComponentLink9URL: https://datasheet.ciiva.com/48530/era-eng-tds-48530575.pdf; ComponentLink9Description: https://datasheet.ciiva.com/48530/era-eng-tds-48530575.pdf; ComponentLink10URL: https://datasheet.ciiva.com/29183/450425-da-01-en-widerstand-0603-era-29183672.pdf; ComponentLink10Description: https://datasheet.ciiva.com/29183/450425-da-01-en-widerstand-0603-era-29183672.pdf; Supplier 1: Digi-Key; Supplier Part Number 1: P180DBDKR-ND
U15 = DS90LV049TMT: IC LDVR/RCVR PAIR LVDS 16TSSOP; Manufacturer: TI National Semiconductor; Max Power Dissipation: 866mW; Number of Receivers: 2; Propagation Delay: 3.5ns; Max Supply Voltage: 3.6V; Min Supply Voltage: 3V; Operating Supply Voltage: 3.3V; Data Rate: 400Mbps; Max Supply Current: 35mA; Number of Channels: 4; Power Consumption: 70W; Logic Function: Transceiver; Supplier 1: Digi-Key; Manufacturer Part Number: DS90LV049TMT; Stock 1: 181; Pricing 1: 1=4.2, 10=3.77, 100=3.0888, 500=2.62944, 1000=2.2176 (USD); Mount: Surface Mount; Case/Package: TSSOP; Number of Pins: 16; Min Operating Temperature: -40°C; Max Operating Temperature: 85°C; Packaging: Rail/Tube; Package Quantity: 92; Number of Elements: 2; Number of Drivers: 2; Turn-On Delay Time: 3.5ns; Power Dissipation: 866mW; Radiation Hardening: No; REACH SVHC: No SVHC; Lead Free: Contains Lead; ComponentLink1URL: https://datasheet.ciiva.com/12262/snls159c-70565-12262450.pdf; ComponentLink1Description: https://datasheet.ciiva.com/12262/snls159c-70565-12262450.pdf; ComponentLink2URL: https://datasheet.ciiva.com/1498/1787948-1498728.pdf; ComponentLink2Description: https://datasheet.ciiva.com/1498/1787948-1498728.pdf; ComponentLink3URL: https://datasheet.ciiva.com/15133/getdatasheetpartid-646755-15133256.pdf; ComponentLink3Description: https://datasheet.ciiva.com/15133/getdatasheetpartid-646755-15133256.pdf; ComponentLink4URL: https://datasheet.ciiva.com/3151/ds90lv049-3151691.pdf; ComponentLink4Description: https://datasheet.ciiva.com/3151/ds90lv049-3151691.pdf; ComponentLink5URL: https://datasheet.ciiva.com/26832/ds90lv049tmt-26832770.pdf; ComponentLink5Description: https://datasheet.ciiva.com/26832/ds90lv049tmt-26832770.pdf
U16 = 74AVC4T245PW,118: Voltage Level Translator Bidirectional 2 Circuit 2 Channel 380Mbps 16-TSSOP; Manufacturer: NXP Semiconductors; Max Supply Voltage: 3.6V; Min Supply Voltage: 800mV; Propagation Delay: 14.7ns; Number of Channels: 4; Number of Elements: 2; Logic Function: Transceiver,Translator; Low Level Output Current: 12mA; Turn-On Delay Time: 14.5ns; Polarity: Non-Inverting; High Level Output Current: -12mA; Quiescent Current: 70uA; Supplier 1: Digi-Key; Stock 1: 22627; Pricing 1: 1=0.9, 10=0.804, 100=0.6266, 500=0.51764, 1000=0.40866 (USD); Mount: Surface Mount; Case/Package: TSSOP; Number of Pins: 16; Contact Plating: Gold; Min Operating Temperature: -40°C; Max Operating Temperature: 125°C; Packaging: Tape and Reel; Package Quantity: 2500; Data Rate: 380Mbps; Number of Bits: 4; Number of Circuits: 2; Radiation Hardening: No; Lead Free: Lead Free; ComponentLink1URL: https://datasheet.ciiva.com/1900/74avc4t245-1900214.pdf; ComponentLink1Description: https://datasheet.ciiva.com/1900/74avc4t245-1900214.pdf; ComponentLink2URL: https://datasheet.ciiva.com/1900/74avc4t245-1900215.pdf; ComponentLink2Description: https://datasheet.ciiva.com/1900/74avc4t245-1900215.pdf; ComponentLink3URL: https://datasheet.ciiva.com/1900/74avc4t245-1900216.pdf; ComponentLink3Description: https://datasheet.ciiva.com/1900/74avc4t245-1900216.pdf; ComponentLink4URL: https://datasheet.ciiva.com/15086/getdatasheetpartid-442686-15086830.pdf; ComponentLink4Description: https://datasheet.ciiva.com/15086/getdatasheetpartid-442686-15086830.pdf; Manufacturer Part Number: 74AVC4T245PW,118

## Sheet Audio_Input_Mic_Preamp.SchDoc: Audio Research: Microphone Preamp
size A4; DrawnBy: Connor Dack; Engineer: Connor Dack; DocumentNumber: 14; Revision: 1.0; SheetNumber: 14; SheetTotal: 20
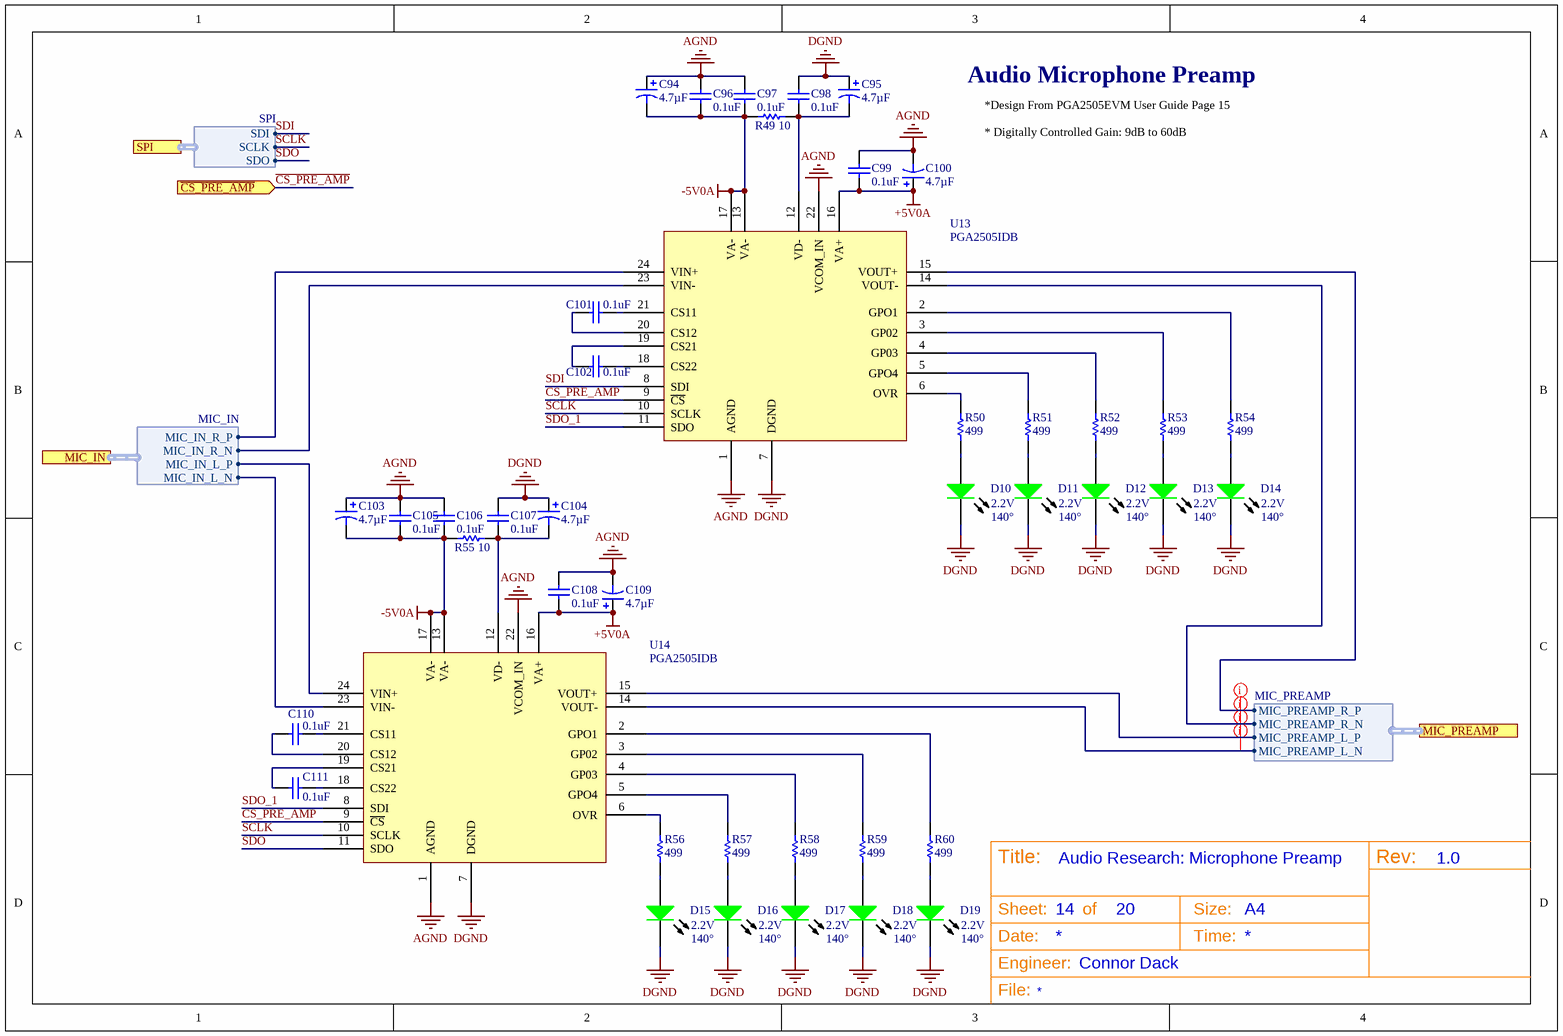
[diagram p13: Audio_Input_Mic_Preamp.SchDoc]

### Parts
C94  Capacitance: 4.7µF  [2917-Tantalum-Cap]  (hidden comment: T495D475K050ATE275)
C95  Capacitance: 4.7µF  [2917-Tantalum-Cap]  (hidden comment: T495D475K050ATE275)
C96  Capacitance: 0.1uF  [3-0603_L]  (hidden comment: CL10F104ZO8NNNC)
C97  Capacitance: 0.1uF  [3-0603_L]  (hidden comment: CL10F104ZO8NNNC)
C98  Capacitance: 0.1uF  [3-0603_L]  (hidden comment: CL10F104ZO8NNNC)
C99  Capacitance: 0.1uF  [3-0603_L]  (hidden comment: CL10F104ZO8NNNC)
C100  Capacitance: 4.7µF  [2917-Tantalum-Cap]  (hidden comment: T495D475K050ATE275)
C101  Capacitance: 0.1uF  [3-0603_L]  (hidden comment: CL10F104ZO8NNNC)
C102  Capacitance: 0.1uF  [3-0603_L]  (hidden comment: CL10F104ZO8NNNC)
C103  Capacitance: 4.7µF  [2917-Tantalum-Cap]  (hidden comment: T495D475K050ATE275)
C104  Capacitance: 4.7µF  [2917-Tantalum-Cap]  (hidden comment: T495D475K050ATE275)
C105  Capacitance: 0.1uF  [3-0603_L]  (hidden comment: CL10F104ZO8NNNC)
C106  Capacitance: 0.1uF  [3-0603_L]  (hidden comment: CL10F104ZO8NNNC)
C107  Capacitance: 0.1uF  [3-0603_L]  (hidden comment: CL10F104ZO8NNNC)
C108  Capacitance: 0.1uF  [3-0603_L]  (hidden comment: CL10F104ZO8NNNC)
C109  Capacitance: 4.7µF  [2917-Tantalum-Cap]  (hidden comment: T495D475K050ATE275)
C110  Capacitance: 0.1uF  [3-0603_L]  (hidden comment: CL10F104ZO8NNNC)
C111  Capacitance: 0.1uF  [3-0603_L]  (hidden comment: CL10F104ZO8NNNC)
D10  Voltage - Forward (Vf) Typ: 2.2V  Viewing Angle: 140°  [DIOCP3216X11L]  (hidden comment: LED_GREEN 2)
D11  Voltage - Forward (Vf) Typ: 2.2V  Viewing Angle: 140°  [DIOCP3216X11L]  (hidden comment: LED_GREEN 2)
D12  Voltage - Forward (Vf) Typ: 2.2V  Viewing Angle: 140°  [DIOCP3216X11L]  (hidden comment: LED_GREEN 2)
D13  Voltage - Forward (Vf) Typ: 2.2V  Viewing Angle: 140°  [DIOCP3216X11L]  (hidden comment: LED_GREEN 2)
D14  Voltage - Forward (Vf) Typ: 2.2V  Viewing Angle: 140°  [DIOCP3216X11L]  (hidden comment: LED_GREEN 2)
D15  Voltage - Forward (Vf) Typ: 2.2V  Viewing Angle: 140°  [DIOCP3216X11L]  (hidden comment: LED_GREEN 2)
D16  Voltage - Forward (Vf) Typ: 2.2V  Viewing Angle: 140°  [DIOCP3216X11L]  (hidden comment: LED_GREEN 2)
D17  Voltage - Forward (Vf) Typ: 2.2V  Viewing Angle: 140°  [DIOCP3216X11L]  (hidden comment: LED_GREEN 2)
D18  Voltage - Forward (Vf) Typ: 2.2V  Viewing Angle: 140°  [DIOCP3216X11L]  (hidden comment: LED_GREEN 2)
D19  Voltage - Forward (Vf) Typ: 2.2V  Viewing Angle: 140°  [DIOCP3216X11L]  (hidden comment: LED_GREEN 2)
R49  Resistance (Ohms): 10  [2-0402_R_L]  (hidden comment: ERJ-2RKF10R0X)
R50  Resistance (Ohms): 499  [3-0603_R_L]  (hidden comment: ERJ-3EKF4990V)
R51  Resistance (Ohms): 499  [3-0603_R_L]  (hidden comment: ERJ-3EKF4990V)
R52  Resistance (Ohms): 499  [3-0603_R_L]  (hidden comment: ERJ-3EKF4990V)
R53  Resistance (Ohms): 499  [3-0603_R_L]  (hidden comment: ERJ-3EKF4990V)
R54  Resistance (Ohms): 499  [3-0603_R_L]  (hidden comment: ERJ-3EKF4990V)
R55  Resistance (Ohms): 10  [2-0402_R_L]  (hidden comment: ERJ-2RKF10R0X)
R56  Resistance (Ohms): 499  [3-0603_R_L]  (hidden comment: ERJ-3EKF4990V)
R57  Resistance (Ohms): 499  [3-0603_R_L]  (hidden comment: ERJ-3EKF4990V)
R58  Resistance (Ohms): 499  [3-0603_R_L]  (hidden comment: ERJ-3EKF4990V)
R59  Resistance (Ohms): 499  [3-0603_R_L]  (hidden comment: ERJ-3EKF4990V)
R60  Resistance (Ohms): 499  [3-0603_R_L]  (hidden comment: ERJ-3EKF4990V)
U13  Microphone Preamp  [SOP65P780X200-24N]  (value not drawn)
U14  Microphone Preamp  [SOP65P780X200-24N]  (value not drawn)

### Ports
MIC_IN (harness MIC_IN), MIC_PREAMP (harness MIC_PREAMP), SPI (harness SPI), ~{CS_PRE_AMP} (in)

### Harnesses
MIC_IN: MIC_IN_R_P, MIC_IN_R_N, MIC_IN_L_N, MIC_IN_L_P
MIC_PREAMP: MIC_PREAMP_R_P, MIC_PREAMP_R_N, MIC_PREAMP_L_N, MIC_PREAMP_L_P
SPI: SDI, SCLK, SDO

### Nets
+5V0A: C99.2 C100.1(P) C108.2 C109.1(P) U13.16(VA+) U14.16(VA+)
-5V0A: C94.2(N) C96.2 C97.2 C103.2(N) C105.2 C106.2 R49.1 R55.1 U13.13(VA-) U13.17(VA-) U14.13(VA-) U14.17(VA-)
AGND: C94.1(P) C95.1(P) C96.1 C97.1 C98.1 C99.1 C100.2(N) C103.1(P) C104.1(P) C105.1 C106.1 C107.1 C108.1 C109.2(N) D10.2(K) D11.2(K) D12.2(K) D13.2(K) D14.2(K) D15.2(K) D16.2(K) D17.2(K) D18.2(K) D19.2(K) U13.1(AGND) U13.7(DGND) U13.22(VCOM_IN) U14.1(AGND) U14.7(DGND) U14.22(VCOM_IN)  [also labelled DGND]
~{CS_PRE_AMP}: U13.9(~{CS}) U14.9(~{CS}) ; port ~{CS_PRE_AMP}
SCLK: U13.10(SCLK) U14.10(SCLK) ; port SPI.SCLK
SDI: U13.8(SDI) ; port SPI.SDI
SDO: U14.11(SDO) ; port SPI.SDO
SDO_1: U13.11(SDO) U14.8(SDI)
NetC70_1: U14.23(VIN-) ; port MIC_IN.MIC_IN_L_N
NetC76_1: U14.24(VIN+) ; port MIC_IN.MIC_IN_L_P
NetC85_1: U13.23(VIN-) ; port MIC_IN.MIC_IN_R_N
NetC90_1: U13.24(VIN+) ; port MIC_IN.MIC_IN_R_P
NetC95_2: C95.2(N) C98.2 R49.2 U13.12(VD-)
NetC101_1: C101.1 U13.21(CS11)
NetC101_2: C101.2 U13.20(CS12)
NetC102_1: C102.1 U13.18(CS22)
NetC102_2: C102.2 U13.19(CS21)
NetC104_2: C104.2(N) C107.2 R55.2 U14.12(VD-)
NetC110_1: C110.1 U14.21(CS11)
NetC110_2: C110.2 U14.20(CS12)
NetC111_1: C111.1 U14.18(CS22)
NetC111_2: C111.2 U14.19(CS21)
NetD10_1: D10.1(A) R50.1
NetD11_1: D11.1(A) R51.1
NetD12_1: D12.1(A) R52.1
NetD13_1: D13.1(A) R53.1
NetD14_1: D14.1(A) R54.1
NetD15_1: D15.1(A) R56.1
NetD16_1: D16.1(A) R57.1
NetD17_1: D17.1(A) R58.1
NetD18_1: D18.1(A) R59.1
NetD19_1: D19.1(A) R60.1
NetR50_2: R50.2 U13.6(OVR)
NetR51_2: R51.2 U13.5(GPO4)
NetR52_2: R52.2 U13.4(GP03)
NetR53_2: R53.2 U13.3(GP02)
NetR54_2: R54.2 U13.2(GPO1)
NetR56_2: R56.2 U14.6(OVR)
NetR57_2: R57.2 U14.5(GPO4)
NetR58_2: R58.2 U14.4(GP03)
NetR59_2: R59.2 U14.3(GP02)
NetR60_2: R60.2 U14.2(GPO1)
NetU1_53: U14.15(VOUT+) ; port MIC_PREAMP.MIC_PREAMP_L_P
NetU1_54: U14.14(VOUT-) ; port MIC_PREAMP.MIC_PREAMP_L_N
NetU1_55: U13.15(VOUT+) ; port MIC_PREAMP.MIC_PREAMP_R_P
NetU1_56: U13.14(VOUT-) ; port MIC_PREAMP.MIC_PREAMP_R_N

### Layout directives
net class Mic_Preamp_In: NetU1_53, NetU1_54, NetU1_55, NetU1_56

### Notes on the sheet
- Audio Microphone Preamp
- *Design From PGA2505EVM User Guide Page 15
  * Digitally Controlled Gain: 9dB to 60dB
- Title:
- Sheet:
- of
- Size:
- A4
- Rev:
- Date:
- Engineer:
- Time:
- File:

### Library data of the parts
C94 C95 C100 C103 C104 C109 = T495D475K050ATE275: CAP TANT 4.7UF 50V 10% 2917; Manufacturer: KEMET; Manufacturer Size Code: D; Type: Molded; ESR (Equivalent Series Resistance): 275 mOhm; Lifetime @ Temp.: 2000 Hrs @ 85°C; Supplier 1: Digi-Key; Manufacturer Part Number: T495D475K050ATE275; RoHS: RoHS Compliant; Category: Capacitors; Stock 1: 9255; Pricing 1: 1=2.05, 10=1.656, 25=1.5052, 50=1.445, 100=1.2644, 250=1.0838 (USD); Packaging: Cut Tape (CT); Part Status: Active; Tolerance: ±10%; Voltage - Rated: 50V; Operating Temperature: -55°C ~ 125°C; Mounting Type: Surface Mount; Package / Case: 2917 (7343 Metric); Size / Dimension: 0.287" L x 0.169" W (7.30mm x 4.30mm); Height - Seated (Max): 0.122" (3.10mm); Lead Spacing: -; Features: General Purpose; Failure Rate: -; ComponentLink1URL: http://www.kemet.com/docfinder?Partnumber=T495D475K050ATE275; ComponentLink1Description: http://www.kemet.com/docfinder?Partnumber=T495D475K050ATE275; Supplier Part Number 1: 399-4786-1-ND
C96-C99 C101 C102 C105-C108 C110 C111 = CL10F104ZO8NNNC: as C69 on sheet Audio_Input_Mic_In; Supplier 1: Digi-Key; Stock 1: 40000; Pricing 1: 1=0.1, 10=0.038, 100=0.0169, 500=0.01208, 1000=0.00949 (USD); Mount: Surface Mount; Case/Package: 0603; Case Code (Metric): 1608; Case Code (Imperial): 0603; Min Operating Temperature: -30°C; Max Operating Temperature: 85°C; Package Quantity: 1; Packaging: Tape and Reel; Voltage Rating: 16V; Dielectric: Y5V; Length: 1.6mm; Height: 0.8mm; Width: 0.031inch; Thickness: 0.035inch; Depth: 0.8mm; Radiation Hardening: No; ComponentLink1URL: https://datasheet.ciiva.com/25805/cl10f104zo8nnnc-25805810.pdf; ComponentLink1Description: https://datasheet.ciiva.com/25805/cl10f104zo8nnnc-25805810.pdf; ComponentLink2URL: https://datasheet.ciiva.com/16199/cl10f104zo8nnnc-16199254.pdf; ComponentLink2Description: https://datasheet.ciiva.com/16199/cl10f104zo8nnnc-16199254.pdf; Supplier Part Number 1: 1276-1258-6-ND; Manufacturer Part Number: CL10F104ZO8NNNC
D10-D19 = LED_GREEN 2: LED ALINGAP ULT GRN CLR 1206 SMD; Manufacturer: Lumex Opto/Components Inc; Manufacturer Part Number: SML-LX1206SUGC-TR; Color: Green; Millicandela Rating: 45mcd; Current - Test: 20mA; Wavelength - Peak: 574nm; Lens Type: Clear; Lens Style/Size: Rectangle with Flat Top, 2mm x 1.6mm; Supplier 1: Digi-Key; RoHS: RoHS Compliant; Category: Optoelectronics; Stock 1: 11785; Pricing 1: 1=0.64, 10=0.49, 100=0.3534, 250=0.31352, 500=0.2679, 1000=0.2109 (USD); Wavelength - Dominant: -; Package / Case: 1206 (3216 Metric); Size / Dimension: 3.20mm L x 1.60mm W; Height: 1.10mm; Mounting Type: Surface Mount; Packaging: Cut Tape (CT); Luminous Flux @ Current - Test: -; ComponentLink1URL: http://www.lumex.com/specs/SML-LX1206SUGC-TR.pdf; ComponentLink1Description: http://www.lumex.com/specs/SML-LX1206SUGC-TR.pdf; Supplier Part Number 1: 67-1698-1-ND
R49 R55 = ERJ-2RKF10R0X: RES 10 OHM 1/10W 1% 0402 SMD; Manufacturer: Panasonic Electronic Components; Power (Watts): 0.1W, 1/10W; Temperature Coefficient: ±100ppm/°C; Supplier 1: Digi-Key; Manufacturer Part Number: ERJ-2RKF10R0X; RoHS: RoHS Compliant; Category: Resistors; Stock 1: 1086258; Pricing 1: 1=0.1, 50=0.0196, 100=0.0149, 250=0.01104, 500=0.00816, 1000=0.00544, 5000=0.00383 (USD); Packaging: Cut Tape (CT); Tolerance: ±1%; Composition: Thick Film; Features: -; Package / Case: 0402 (1005 Metric); Supplier Device Package: 0402; Size / Dimension: 0.039" L x 0.020" W (1.00mm x 0.50mm); Height: 0.016" (0.40mm); Number of Terminations: 2; ComponentLink1URL: http://industrial.panasonic.com/www-cgi/jvcr13pz.cgi?E+PZ+3+AOA0002+ERJ2RKF10R0X+7+WW; ComponentLink1Description: http://industrial.panasonic.com/www-cgi/jvcr13pz.cgi?E+PZ+3+AOA0002+ERJ2RKF10R0X+7+WW; Supplier Part Number 1: P10.0LCT-ND
R50-R54 R56-R60 = ERJ-3EKF4990V: RES 499 OHM 1/10W 1% 0603 SMD; Manufacturer: Panasonic - ECG; Power (Watts): 0.1W, 1/10W; Temperature Coefficient: ±100ppm/°C; Supplier 1: Digi-Key; Manufacturer Part Number: ERJ-3EKF4990V; RoHS: RoHS Compliant; Category: Resistors; Stock 1: 748630; Pricing 1: 1=0.1, 50=0.0138, 100=0.0105, 250=0.0078, 500=0.00576, 1000=0.00384 (USD); Composition: Thick Film; Features: -; Tolerance: ±1%; Package / Case: 0603 (1608 Metric); Size / Dimension: 0.063" L x 0.031" W (1.60mm x 0.80mm); Height: 0.022" (0.55mm); Number of Terminations: 2; Packaging: Cut Tape (CT); ComponentLink1URL: http://industrial.panasonic.com/www-cgi/jvcr13pz.cgi?E+PZ+3+AOA0002+ERJ3EKF4990V+7+WW; ComponentLink1Description: http://industrial.panasonic.com/www-cgi/jvcr13pz.cgi?E+PZ+3+AOA0002+ERJ3EKF4990V+7+WW; Supplier Part Number 1: P499HCT-ND
U13 U14 = PGA2505IDB: IC DGTL CTRLR MICOPHN AMP 24SSOP; Manufacturer: Texas Instruments; Number of Channels: 1; Max Supply Voltage: 5.25V; Min Supply Voltage: 4.75V; Operating Supply Current: 30mA; Input Offset Voltage (Vos): 1mV; Gain: 60dB; Interface: SPI; Dual Supply Voltage: 5V; Input Voltage Noise Density: 3nV/sqrt Hz; Min Dual Supply Voltage: -4.75V; Load Impedance: 600R; Supplier 1: Digi-Key; Stock 1: 358; Pricing 1: 1=10.98, 10=10.088, 100=8.52, 500=7.5792, 1000=6.9519 (USD); Case/Package: SSOP; Number of Pins: 24; Weight: 0.007764oz; Min Operating Temperature: -40°C; Max Operating Temperature: 85°C; Packaging: Rail/Tube; Package Quantity: 60; Max Input Voltage: 5.25V; Quiescent Current: 30mA; Max Dual Supply Voltage: 5.25V; Operating Supply Voltage: 5V; Length: 8.2mm; Height: 1.95mm; Width: 5.3mm; Radiation Hardening: No; REACH SVHC: No SVHC; Lead Free: Lead Free; ComponentLink1URL: https://datasheet.ciiva.com/1789/pga2505-1789587.pdf; ComponentLink1Description: https://datasheet.ciiva.com/1789/pga2505-1789587.pdf; ComponentLink2URL: https://datasheet.ciiva.com/2968/pga2505-2968036.pdf; ComponentLink2Description: https://datasheet.ciiva.com/2968/pga2505-2968036.pdf; ComponentLink3URL: https://datasheet.ciiva.com/15131/getdatasheetpartid-220694-15131828.pdf; ComponentLink3Description: https://datasheet.ciiva.com/15131/getdatasheetpartid-220694-15131828.pdf; ComponentLink4URL: https://datasheet.ciiva.com/26118/sbos396b-26118602.pdf; ComponentLink4Description: https://datasheet.ciiva.com/26118/sbos396b-26118602.pdf; ComponentLink5URL: https://datasheet.ciiva.com/1481/1772560-1481451.pdf; ComponentLink5Description: https://datasheet.ciiva.com/1481/1772560-1481451.pdf; ComponentLink6URL: https://datasheet.ciiva.com/26842/pga2505idb-26842003.pdf; ComponentLink6Description: https://datasheet.ciiva.com/26842/pga2505idb-26842003.pdf; Supplier Part Number 1: 296-24572-5-ND; Manufacturer Part Number: PGA2505IDB